# EAGLE schematic 18650BatteryCapacitanceR1 (EAGLE 7.6.0)
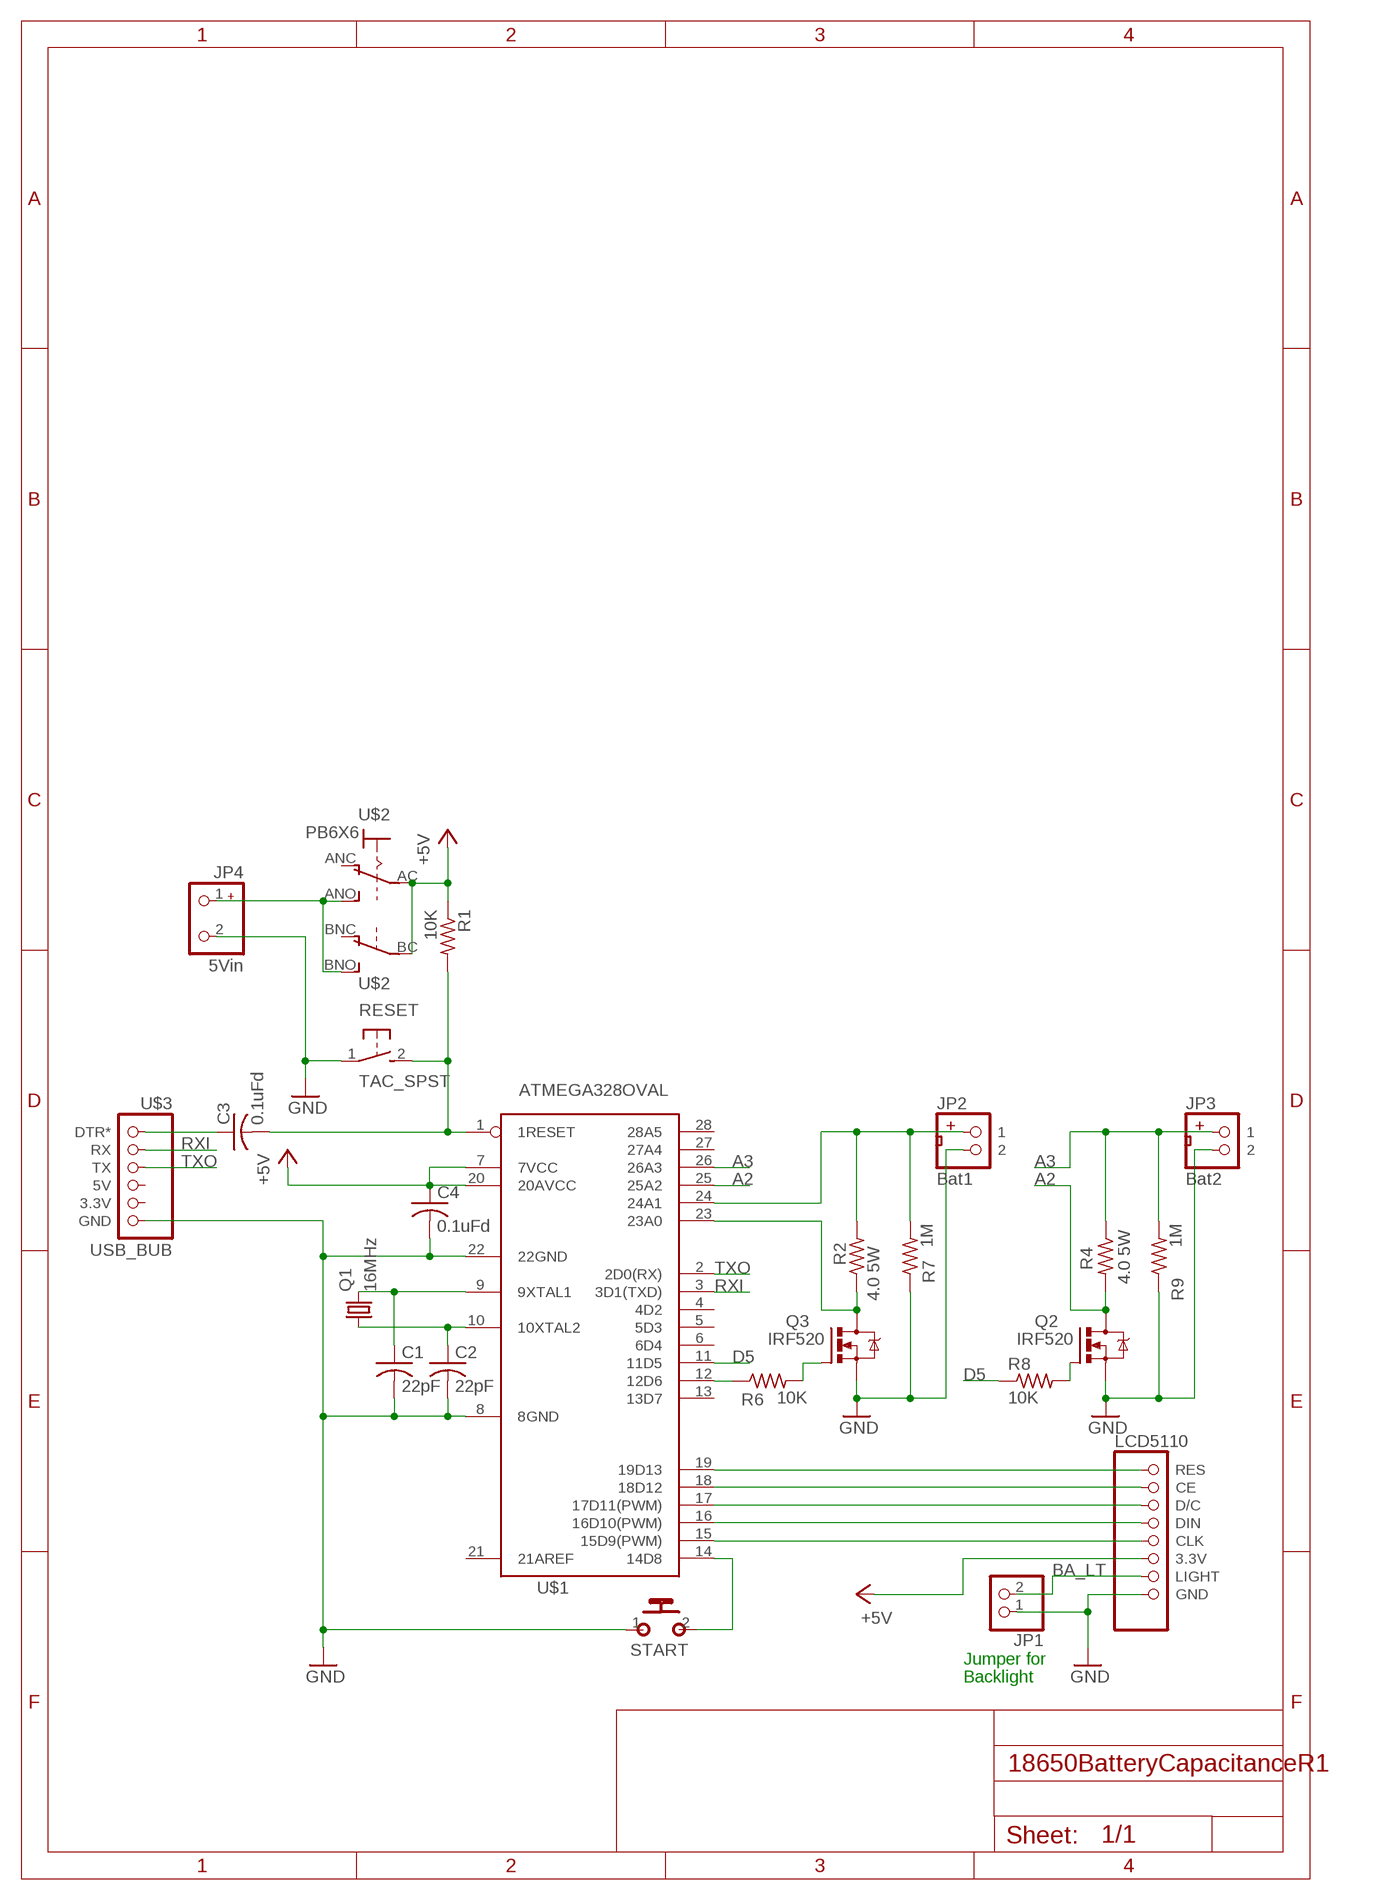
[diagram p0: schematic, sheet 1]

## Parts
C1  22pF  C-US025-025X050  [C025-025X050]
C2  22pF  C-US025-025X050  [C025-025X050]
C3  0.1uFd  C-US075-032X103  [C075-032X103]
C4  0.1uFd  C-US025-025X050  [C025-025X050]
JP1  PINHD-1X2  [1X02]
JP2  Bat1  JST2.0  [JST2.0]
JP3  Bat2  JST2.0  [JST2.0]
JP4  5Vin  KF301  [KF301]
LCD5110  LCD5110_1TOP  [LCD5110T1]
Q1  16MHz  CRYSTALHC49S  [HC49/S]
Q2  IRF520  [TO220BV]
Q3  IRF520  [TO220BV]
R1  10K  R-US_0207/7  [0207/7]
R2  4.0 5W  R-US_0922/22  [0922/22]
R4  4.0 5W  R-US_0922/22  [0922/22]
R6  10K  R-US_0207/7  [0207/7]
R7  1M  R-US_0207/2V  [0207/2V]
R8  10K  R-US_0207/7  [0207/7]
R9  1M  R-US_0207/2V  [0207/2V]
RESET  TAC_SPST  [TACTILE-SPST]
START  MOMENTARY  [SPST]
U$1  ATMEGA328OVAL  [DIL28-3]
U$2  PB6X6  [PB6X6]
U$3  USB_BUB  [USB_BUB]

## Nets
+5V: C4.1 LCD5110.3.3V R1.1 U$1.7(7VCC) U$1.20(20AVCC) U$2.AC(P) U$2.BC(P)
A2: Q2.D R4.2 U$1.25(25A2)
A3: JP3.1 R4.1 R9.2 U$1.26(26A3)
BA_LT: JP1.2 LCD5110.LIGHT
D5: R8.1 U$1.11(11D5)
GND: C1.2 C2.2 C4.2 JP1.1 JP2.2 JP3.2 JP4.2 LCD5110.GND Q2.S Q3.S R7.1 R9.1 RESET.1 START.1(P) U$1.8(8GND) U$1.22(22GND) U$3.GND
N$1: C1.1 Q1.2 U$1.9(9XTAL1)
N$2: C2.1 Q1.1 U$1.10(10XTAL2)
N$4: JP4.1 U$2.ANO(S) U$2.BNO(S)
N$5: START.2(S) U$1.14(14D8)
N$6: C3.2 R1.2 RESET.2 U$1.1(1RESET)
N$7: C3.1 U$3.DTR*
N$8: Q2.G R8.2
N$10: LCD5110.RES U$1.19(19D13)
N$11: LCD5110.CE U$1.18(18D12)
N$12: LCD5110.D/C U$1.17(17D11(PWM))
N$13: LCD5110.DIN U$1.16(16D10(PWM))
N$14: LCD5110.CLK U$1.15(15D9(PWM))
N$15: R6.1 U$1.12(12D6)
N$16: Q3.G R6.2
N$18: Q3.D R2.1 U$1.23(23A0)
N$20: JP2.1 R2.2 R7.2 U$1.24(24A1)
RXI: U$1.3(3D1(TXD)) U$3.RX
TXO: U$1.2(2D0(RX)) U$3.TX
Unconnected: U$1.4(4D2) U$1.5(5D3) U$1.6(6D4) U$1.13(13D7) U$1.21(21AREF) U$1.27(27A4) U$1.28(28A5) U$2.ANC(O) U$2.BNC(O) U$3.3.3V U$3.5V

## Notes on the sheet
- Jumper for
- Backlight

## Library data of the parts
C1-C4 = rcl:C-US: CAPACITOR, American symbol
JP1 = pinhead:PINHD-1X2: PIN HEADER
JP2 JP3 = MTS_Custom:JST2.0
JP4 = MTS_Custom:KF301
LCD5110 = MTS_Custom:LCD5110_1
Q1 = crystal:CRYSTAL: CRYSTAL; OC_FARNELL: 1667008; OC_NEWARK: unknown
Q2 Q3 = transistor-power:IRF520: HEXFET Power MOSFET
R1 R6-R9 = rcl:R-US_: RESISTOR, American symbol
R2 R4 = resistor:R-US_: RESISTOR, American symbol
RESET = MTS_Custom:TAC_SPST: Tactile switch SPST 7mm lead spacing
START = MTS_Custom:MOMENTARY
U$1 = MTS_Custom:ATMEGA328
U$2 = MTS_Custom:PB6X6: Pushbutton 6mm x 6mm DPDT. should be the same for momentary and latching.
U$3 = MTS:USB_BUB